# EAGLE design EmonESP (EAGLE 9.6.2)
CNAME: EmonESP WiFi module based on Wemos D1 mini; CREVISION: v0.1; DESIGNER: Stanley
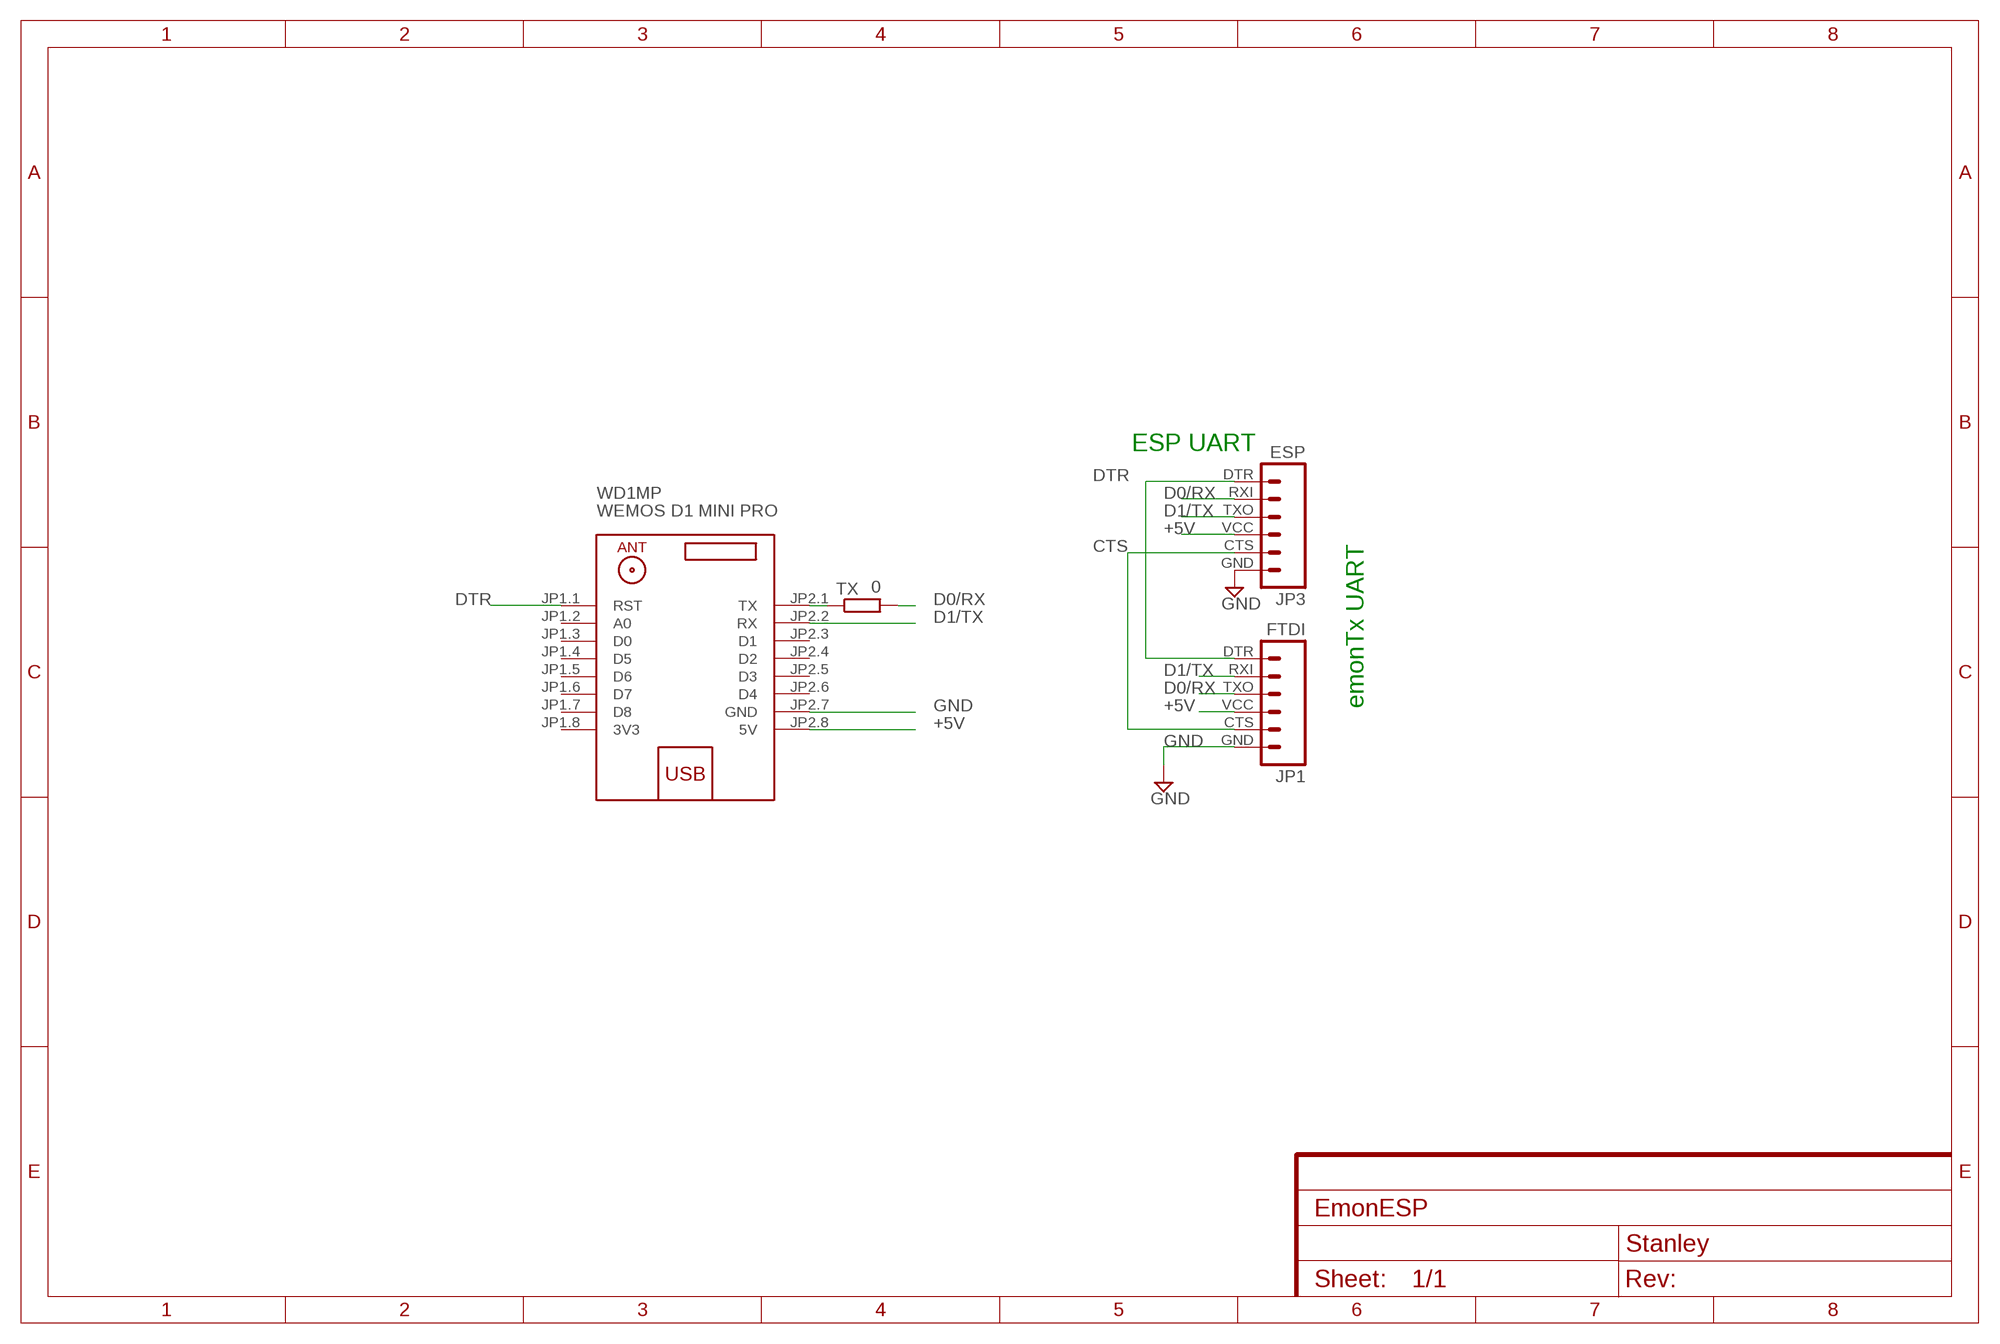
[diagram p0: schematic, sheet 1]

## Parts
JP1  FTDI  FTDI_BASICPTH  [FTDI_BASIC]
JP3  ESP  FTDI_BASICPTH  [FTDI_BASIC]
TX  0  R-EU_R0603  [R0603]
WD1MP  WEMOS D1 MINI PRO  WEMOS-D1-MINI-PRO  [WEMOS-D1-MINI-PRO]

## Nets
+5V [power]: JP1.VCC JP3.VCC WD1MP.JP2.8(5V)
CTS: JP1.CTS JP3.CTS
D0/RX: JP1.TXO JP3.RXI TX.2
D1/TX: JP1.RXI JP3.TXO WD1MP.JP2.2(RX)
DTR: JP1.DTR JP3.DTR WD1MP.JP1.1(RST)
GND [gnd]: JP1.GND JP3.GND WD1MP.JP2.7(GND)
N$1: TX.1 WD1MP.JP2.1(TX)
Unconnected: WD1MP.JP1.2(A0) WD1MP.JP1.3(D0) WD1MP.JP1.4(D5) WD1MP.JP1.5(D6) WD1MP.JP1.6(D7) WD1MP.JP1.7(D8) WD1MP.JP2.3(D1) WD1MP.JP2.4(D2) WD1MP.JP2.5(D3) WD1MP.JP2.6(D4)

## Notes on the sheet
- ESP UART
- emonTx UART

## Power pins joined to a net without a drawn wire
3V3: WD1MP.JP1.8(3V3)

## Library data of the parts
JP1 JP3 = SparkFun:FTDI_BASIC: FTDI Basic: 3.3V and 5V
TX = rcl:R-EU_: RESISTOR, European symbol; SPICEPREFIX: R
WD1MP = diy-modules:WEMOS-D1-MINI-PRO: WEMOS D1 mini Pro: Mini Wi-Fi Board based on ESP-8266EX chip More details can be found here: https://www.wemos.cc/product/d1-mini-pro.html Click here to find device on ebay.com <http://www.ebay.com/sch/wemos+d1+mini+pro>

## Net classes
0 default: width 0.203 mm, drill 0.6 mm, clearance 0.203 mm
1 power: width 0.254 mm, drill 0.6 mm, clearance 0.203 mm
2 gnd: width 0.254 mm, drill 0.6 mm, clearance 0.203 mm

## Board
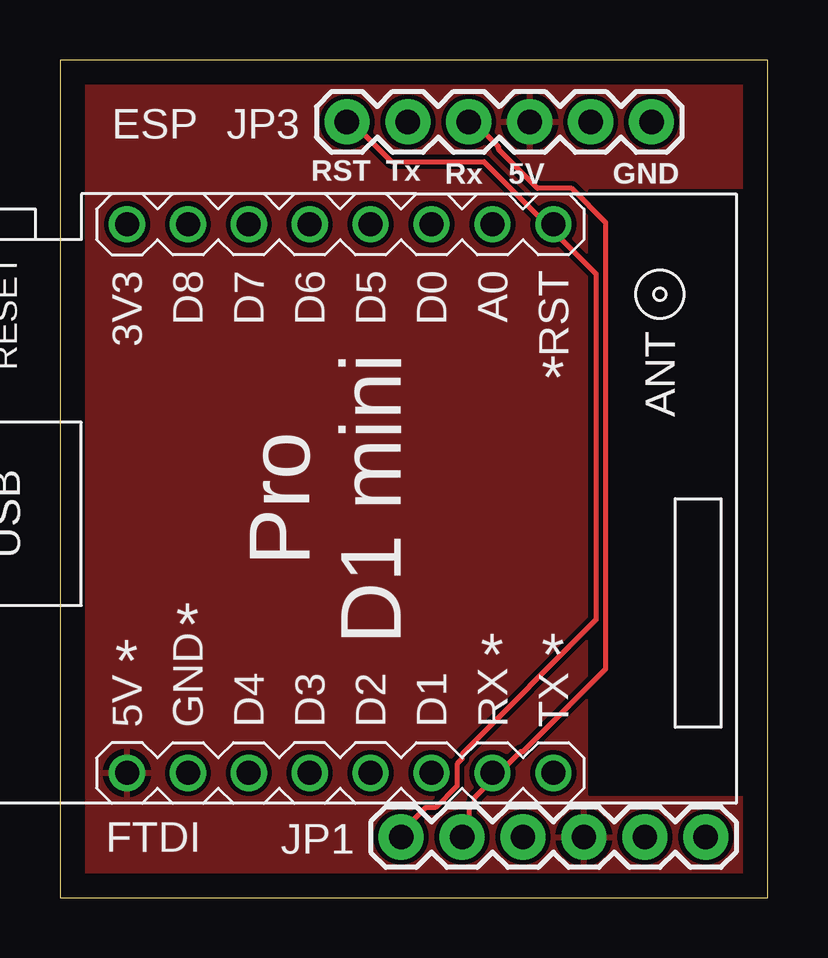
[diagram p1: board, top side]
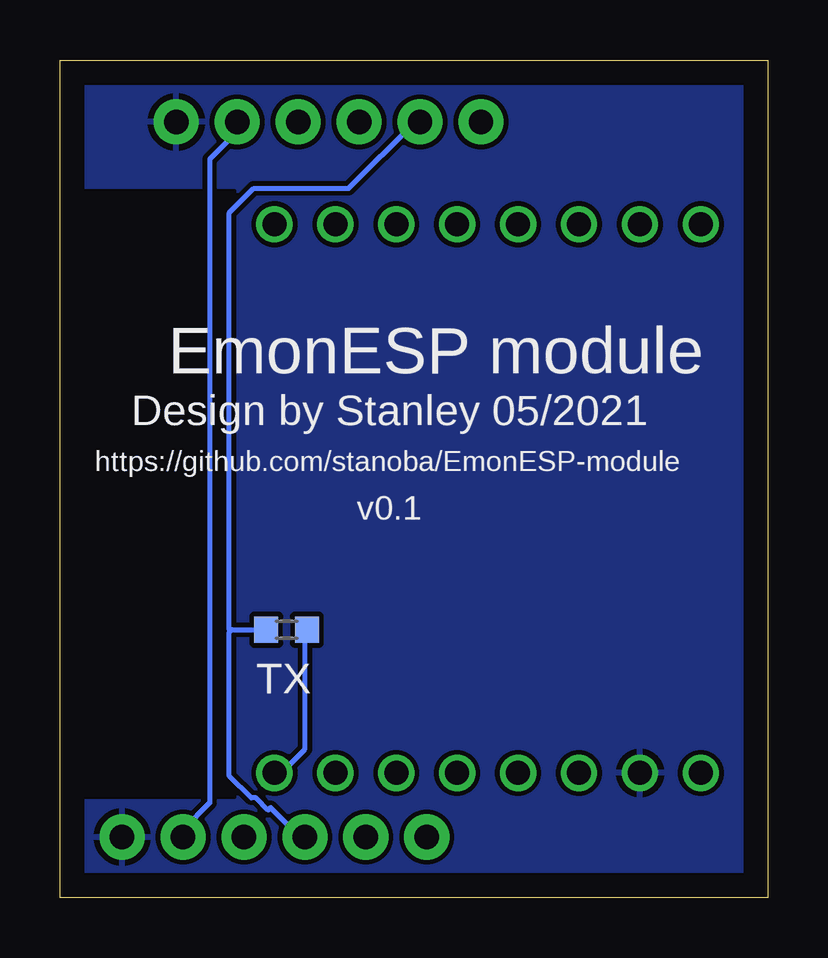
[diagram p2: board, bottom side, seen from below]

Size 29.52 x 34.91 mm. Coordinates in mm from the lower left corner, seen from the top.
Outline: 0,0 29.52,0 29.52,34.91 0,34.91 0,0
Copper layers (1*16): Top 0.035mm / dielectric 1.5mm / Bottom 0.035mm
Design rules "default": minimum track width 6mil, minimum drill 0.35mm, track to track 6mil, track to pad 6mil, pad to pad 6mil, via to via 6mil, smd to smd 6mil, copper to edge 40mil, drill to drill 6mil, minimum pad ring 10mil, minimum via ring 8mil, stop-mask expansion 4mil, vias tented up to drill 0mil, thermal gap 10mil

### Footprints (pad centres in the part's own frame; a part is rotated, then mirrored left to right if it is on the bottom)
FTDI_BASIC = drill 1.016 pad 1.88: CTS 10.16,0; DTR 0,0; GND 12.7,0; RXI 2.54,0; TXO 5.08,0; VCC 7.62,0
R0603 = smd 1 x 1.1: 1 -0.85,0; 2 0.85,0
WEMOS-D1-MINI-PRO = drill 1: JP1.1 -11.43,9.525; JP1.2 -11.43,6.985; JP1.3 -11.43,4.445; JP1.4 -11.43,1.905; JP1.5 -11.43,-0.635; JP1.6 -11.43,-3.175; JP1.7 -11.43,-5.715; JP1.8 -11.43,-8.255; JP2.1 11.43,9.525; JP2.2 11.43,6.985; JP2.3 11.43,4.445; JP2.4 11.43,1.905; JP2.5 11.43,-0.635; JP2.6 11.43,-3.175; JP2.7 11.43,-5.715; JP2.8 11.43,-8.255

### Placement (x,y rotation side)
JP1  14.22,2.54 0 top
JP3  11.96,32.33 0 top
TX  20.07,11.18 180 bottom
WD1MP  11.05,16.64 270 top

### Tracks (layer width: path | path; a pad name or v marks a point on that pad's centre or on a via)
+5V
  pour Top: 0,37.85 0,-5.59 34.92,-5.59 34.92,37.85
CTS
  Bottom 0.203: JP1.CTS 24.38,2.85 23.27,3.96 23.27,30.79 22.15,31.9 22.15,32.31 JP3.CTS
D0/RX
  Bottom 0.203: TX.2 22.35,11.18 22.4,11.12 | 22.4,11.12 22.45,11.07 22.45,5.08 21.54,4.17 21.34,4.17 20.83,3.66 20.73,3.76 19.51,2.54 JP1.TXO | JP3.RXI 14.53,32.31 14.73,32.31 17.48,29.57 21.44,29.57 22.45,28.55 22.45,11.18 22.4,11.12
D1/TX
  Top 0.203: JP1.RXI 16.76,3.15 17.07,3.45 17.07,3.76 17.27,3.96 17.27,4.17 17.98,4.88 17.98,5.18 WD1MP.JP2.2 18.09,5.28 18.39,5.28 19.2,6.1 19.3,6.1 22.76,9.55 22.76,28.14 21.34,29.57 19.91,29.57 18.29,31.19 18.29,31.29 17.27,32.31 17.07,32.31 JP3.TXO
DTR
  Top 0.203: JP3.DTR 11.99,32.31 12.19,32.31 13.82,30.68 17.68,30.68 20.22,28.14 20.52,28.14 WD1MP.JP1.1 20.62,28.04 20.62,27.74 22.35,26.01 22.35,11.58 16.76,5.99 16.76,5.79 16.56,5.59 16.56,4.67 15.65,3.76 15.24,3.76 14.22,2.74 JP1.DTR
GND
  pour Bottom: -0.64,37.72 -0.64,-0.64 30.99,-0.64 30.99,37.72
N$1
  Bottom 0.203: TX.1 19.3,11.18 19.3,6.2 20.22,5.28 20.52,5.28 WD1MP.JP2.1
N$2
  cutout Top: 33.15,29.46 22.1,29.46 22.1,4.32 33.15,4.32
N$3
  cutout Bottom: 33.02,29.46 22.23,29.46 22.23,4.19 33.02,4.19

### Text on the board
tNames: ESP | RST | Tx | Rx | 5V | GND | * | * | * | * | * | FTDI
bNames: EmonESP module | Design by Stanley 05/2021 | https://github.com/stanoba/EmonESP-module | v0.1